# Altium project DSP-V1.0.PrjPcb
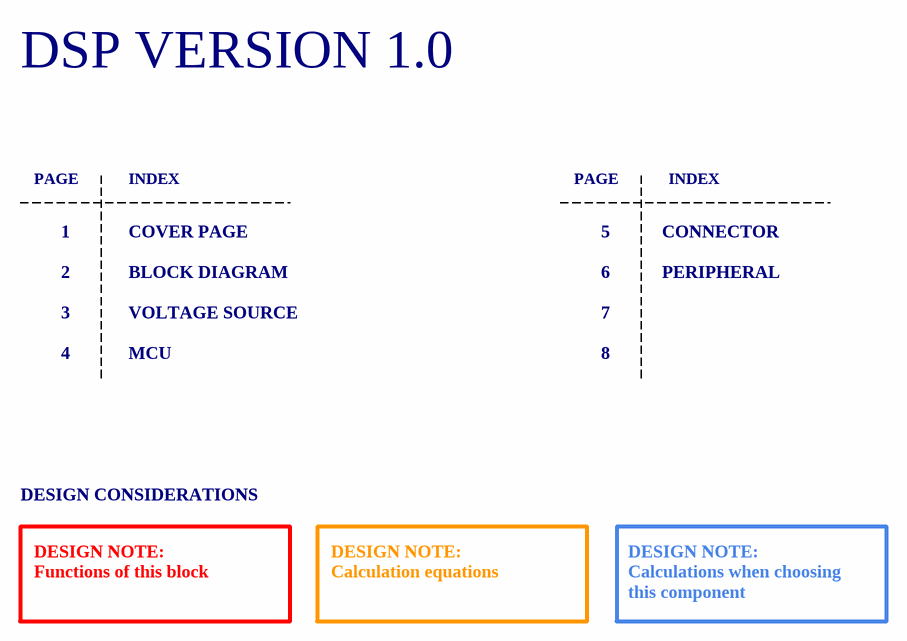
[diagram p0: Cover Page.SchDoc]
6 sheets, 226 parts. Net scope: global (net labels, ports and power ports of the same name join across sheets).
Board files: DSP-V1.0.PcbDoc, assembly.PcbDoc
Sheets:
  Cover Page.SchDoc
  Block Diagram.SchDoc
  Voltage Source.SchDoc
  MCU.SchDoc
  CONNECTOR.SchDoc
  PERIPHERAL.SchDoc

## Sheet Cover Page.SchDoc: Cover Page
size A4; Author: DODANHLUONG; Revision: 1.0; SheetNumber: 1; SheetTotal: 5; ProjectTitle: DSP_VERSION_1.0

### Notes on the sheet
- DSP VERSION 1.0
- PAGE
- INDEX
- 1
- 2
- COVER PAGE
- BLOCK DIAGRAM
- 5
- 6
- CONNECTOR
- PERIPHERAL
- 3
- 4
- VOLTAGE SOURCE
- MCU
- 7
- 8
- DESIGN CONSIDERATIONS
- DESIGN NOTE:
  Functions of this block
- DESIGN NOTE:
  Calculation equations
- DESIGN NOTE:
  Calculations when choosing this component
- Author:
- Title:
- Size:
- A4
- Project:
- Approved:
- Revision:
- Modified Date:
- CONFIDENTIAL
- Date:
- SW Version:

## Sheet Block Diagram.SchDoc: Block Diagram
size A4; Author: DODANHLUONG; Revision: 1.0; SheetNumber: 2; SheetTotal: 6; ProjectTitle: DSP_VERSION_1.0

### Notes on the sheet
- Author:
- Title:
- Size:
- A4
- Project:
- Approved:
- Revision:
- Modified Date:
- CONFIDENTIAL
- Date:
- SW Version:

## Sheet Voltage Source.SchDoc: Voltage Source
size A3; Author: DODANHLUONG; Revision: 1.0; SheetNumber: 3; SheetTotal: 6; ProjectTitle: DSP_VERSION_1.0
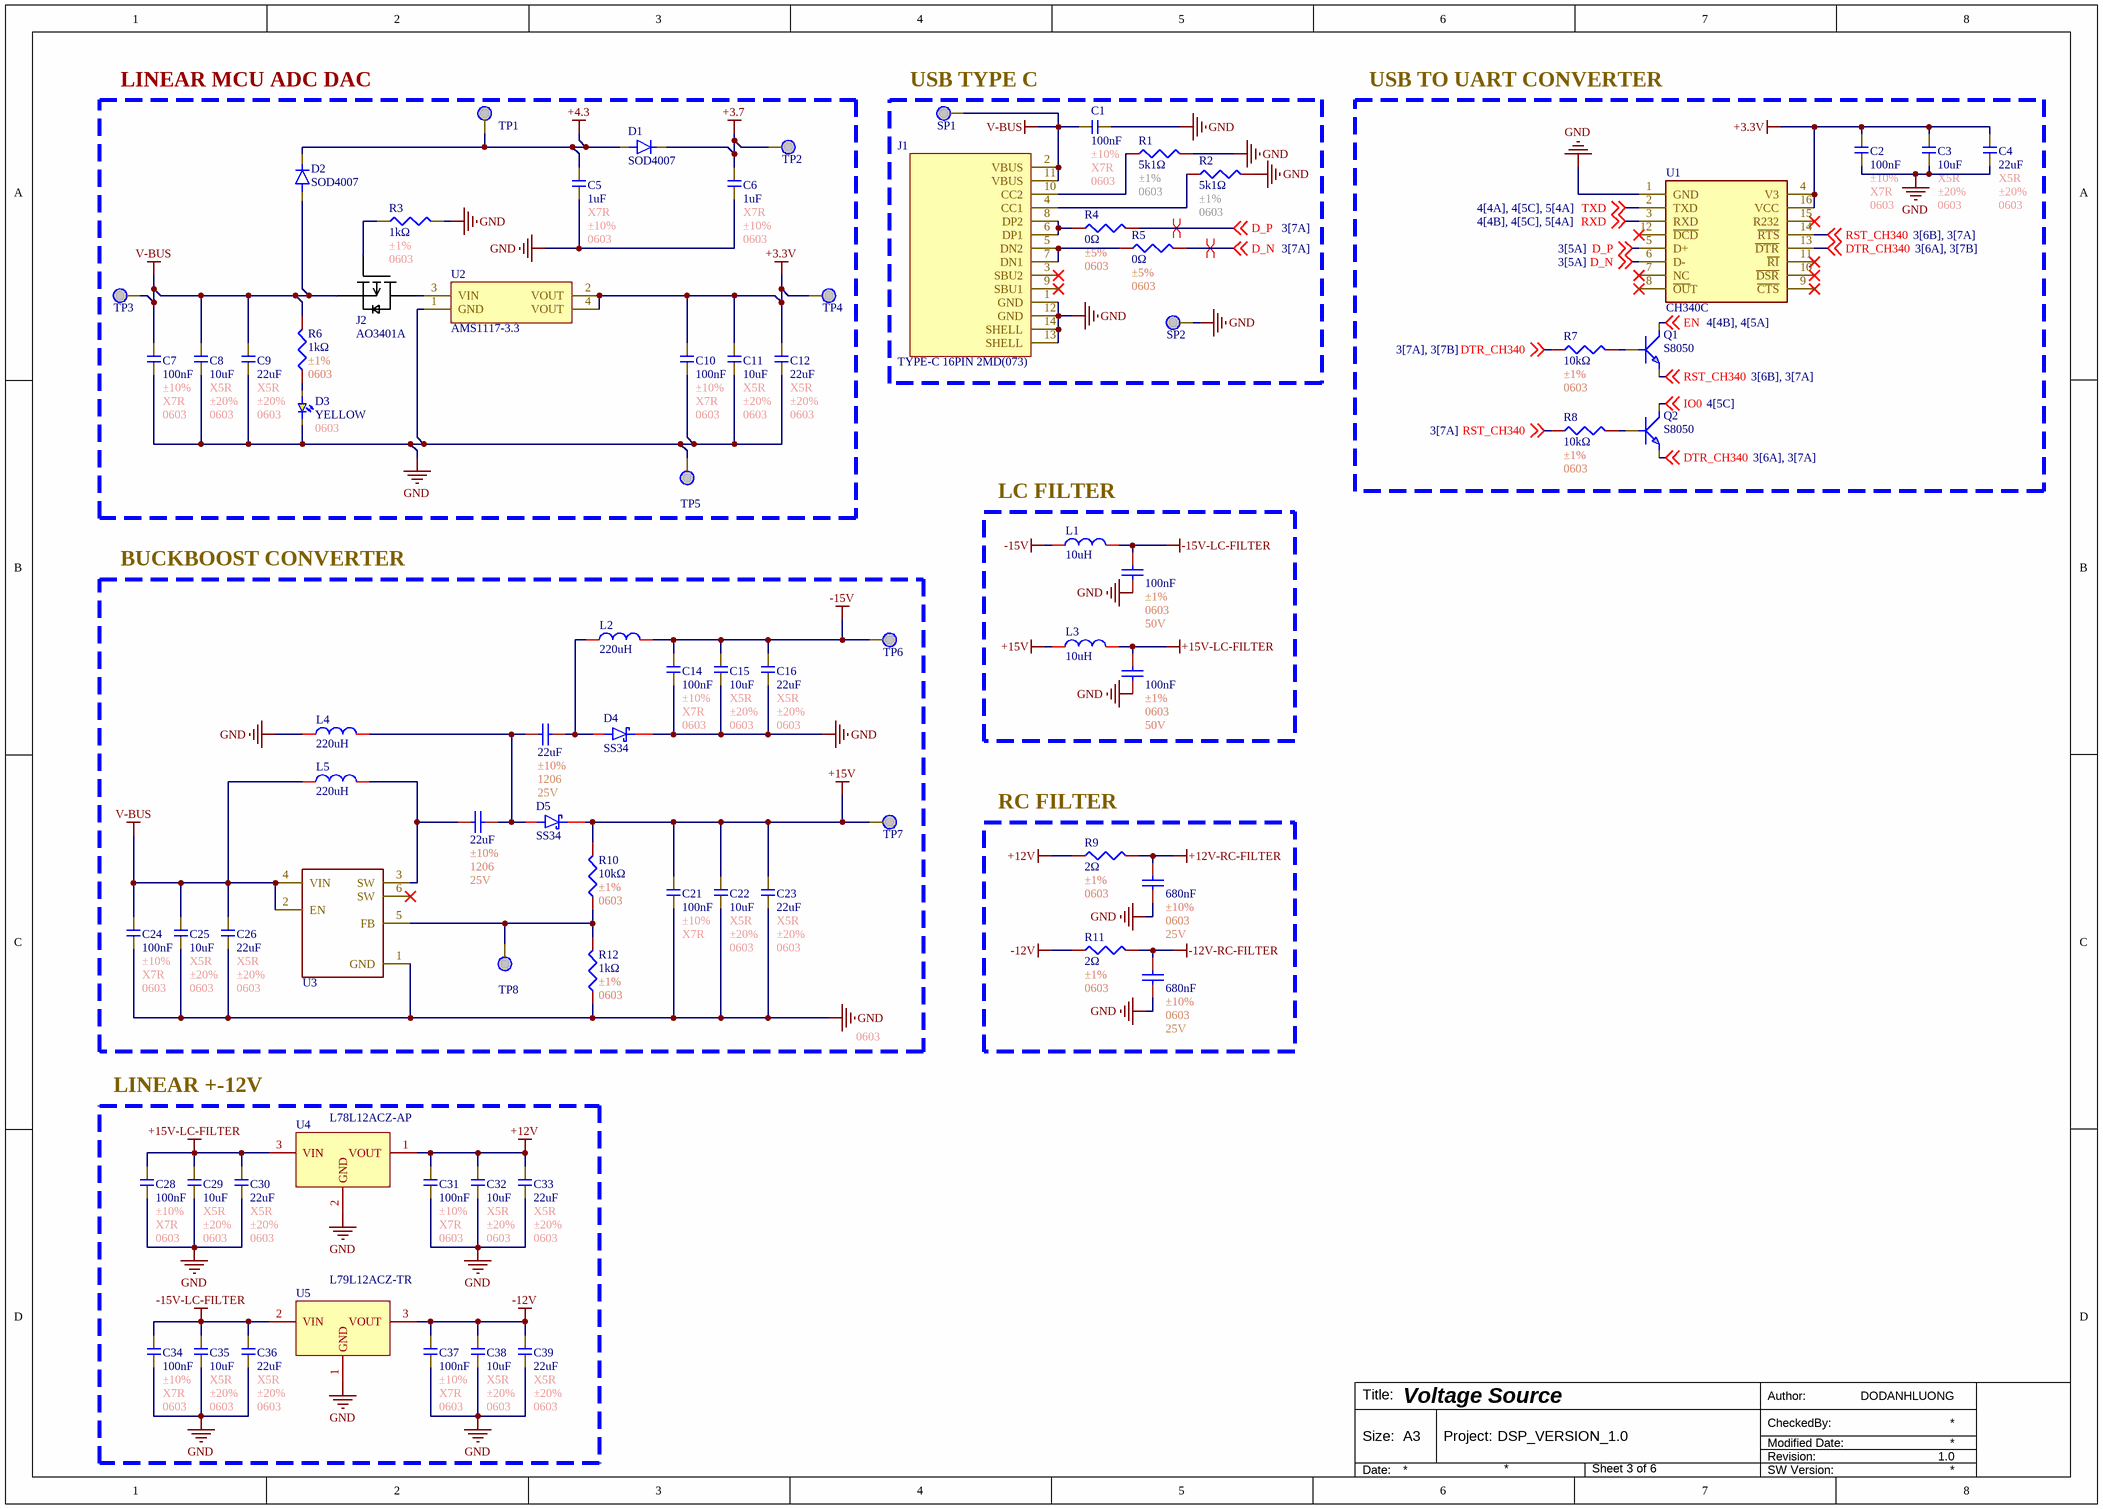
[diagram p1: Voltage Source.SchDoc]

### Parts
C1  100nF  Tolerance: ±10%  Temperature Coefficient: X7R  Package: 0603  [C0603]
C2  100nF  Tolerance: ±10%  Temperature Coefficient: X7R  Package: 0603  [C0603]
C3  10uF  Temperature Coefficient: X5R  Tolerance: ±20%  Package: 0603  [C0603]
C4  22uF  Temperature Coefficient: X5R  Tolerance: ±20%  Package: 0603  [C0603]
C5  1uF  Temperature Coefficient: X7R  Tolerance: ±10%  Package: 0603  [C0603]
C6  1uF  Temperature Coefficient: X7R  Tolerance: ±10%  Package: 0603  [C0603]
C7  100nF  Tolerance: ±10%  Temperature Coefficient: X7R  Package: 0603  [C0603]
C8  10uF  Temperature Coefficient: X5R  Tolerance: ±20%  Package: 0603  [C0603]
C9  22uF  Temperature Coefficient: X5R  Tolerance: ±20%  Package: 0603  [C0603]
C10  100nF  Tolerance: ±10%  Temperature Coefficient: X7R  Package: 0603  [C0603]
C11  10uF  Temperature Coefficient: X5R  Tolerance: ±20%  Package: 0603  [C0603]
C12  22uF  Temperature Coefficient: X5R  Tolerance: ±20%  Package: 0603  [C0603]
C13  100nF  Tolerance: ±1%  Package: 0603  Voltage Rating: 50V  [C0603]
C14  100nF  Tolerance: ±10%  Temperature Coefficient: X7R  Package: 0603  [C0603]
C15  10uF  Temperature Coefficient: X5R  Tolerance: ±20%  Package: 0603  [C0603]
C16  22uF  Temperature Coefficient: X5R  Tolerance: ±20%  Package: 0603  [C0603]
C17  100nF  Tolerance: ±1%  Package: 0603  Voltage Rating: 50V  [C0603]
C18  22uF  Tolerance: ±10%  Package: 1206  Voltage Rating: 25V  [C1206]
C19  22uF  Tolerance: ±10%  Package: 1206  Voltage Rating: 25V  [C1206]
C20  680nF  Tolerance: ±10%  Package: 0603  Voltage Rating: 25V  [C0603]
C21  100nF  Tolerance: ±10%  Temperature Coefficient: X7R  Package: 0603  [C0603]
C22  10uF  Temperature Coefficient: X5R  Tolerance: ±20%  Package: 0603  [C0603]
C23  22uF  Temperature Coefficient: X5R  Tolerance: ±20%  Package: 0603  [C0603]
C24  100nF  Tolerance: ±10%  Temperature Coefficient: X7R  Package: 0603  [C0603]
C25  10uF  Temperature Coefficient: X5R  Tolerance: ±20%  Package: 0603  [C0603]
C26  22uF  Temperature Coefficient: X5R  Tolerance: ±20%  Package: 0603  [C0603]
C27  680nF  Tolerance: ±10%  Package: 0603  Voltage Rating: 25V  [C0603]
C28  100nF  Tolerance: ±10%  Temperature Coefficient: X7R  Package: 0603  [C0603]
C29  10uF  Temperature Coefficient: X5R  Tolerance: ±20%  Package: 0603  [C0603]
C30  22uF  Temperature Coefficient: X5R  Tolerance: ±20%  Package: 0603  [C0603]
C31  100nF  Tolerance: ±10%  Temperature Coefficient: X7R  Package: 0603  [C0603]
C32  10uF  Temperature Coefficient: X5R  Tolerance: ±20%  Package: 0603  [C0603]
C33  22uF  Temperature Coefficient: X5R  Tolerance: ±20%  Package: 0603  [C0603]
C34  100nF  Tolerance: ±10%  Temperature Coefficient: X7R  Package: 0603  [C0603]
C35  10uF  Temperature Coefficient: X5R  Tolerance: ±20%  Package: 0603  [C0603]
C36  22uF  Temperature Coefficient: X5R  Tolerance: ±20%  Package: 0603  [C0603]
C37  100nF  Tolerance: ±10%  Temperature Coefficient: X7R  Package: 0603  [C0603]
C38  10uF  Temperature Coefficient: X5R  Tolerance: ±20%  Package: 0603  [C0603]
C39  22uF  Temperature Coefficient: X5R  Tolerance: ±20%  Package: 0603  [C0603]
D1  SOD4007  [SOD4007]
D2  SOD4007  [SOD4007]
D3  YELLOW  Package: 0603  [LED0603]
D4  SS34  [SS34]
D5  SS34  [SS34]
J1  TYPE-C 16PIN 2MD(073)  [TYPE_C_FAMALE]
J2  AO3401A  [AO3401A]
L1  10uH  [CD43]
L2  220uH  [CD43]
L3  10uH  [CD43]
L4  220uH  [CD43]
L5  220uH  [CD43]
Q1  S8050  [S8050]
Q2  S8050  [S8050]
R1  5k1Ω  Tolerance: ±1%  Package: 0603  [R0603]
R2  5k1Ω  Tolerance: ±1%  Package: 0603  [R0603]
R3  1kΩ  Tolerance: ±1%  Package: 0603  [R0603]
R4  0Ω  Tolerance: ±5%  Package: 0603  [R0603]
R5  0Ω  Tolerance: ±5%  Package: 0603  [R0603]
R6  1kΩ  Tolerance: ±1%  Package: 0603  [R0603]
R7  10kΩ  Tolerance: ±1%  Package: 0603  [R0603]
R8  10kΩ  Tolerance: ±1%  Package: 0603  [R0603]
R9  2Ω  Tolerance: ±1%  Package: 0603  [R0603]
R10  10kΩ  Tolerance: ±1%  Package: 0603  [R0603]
R11  2Ω  Tolerance: ±1%  Package: 0603  [R0603]
R12  1kΩ  Tolerance: ±1%  Package: 0603  [R0603]
SP1  SP  [SP]  (value not drawn)
SP2  SP  [SP]  (value not drawn)
TP1  TP  [TP]  (value not drawn)
TP2  TP  [TP]  (value not drawn)
TP3  TP  [TP]  (value not drawn)
TP4  TP  [TP]  (value not drawn)
TP5  TP  [TP]  (value not drawn)
TP6  TP  [TP]  (value not drawn)
TP7  TP  [TP]  (value not drawn)
TP8  TP  [TP]  (value not drawn)
U1  CH340C  [CH340C]
U2  AMS1117-3.3  [AMS1117-3.3]
U3  XL6009  [XL6009]  (value not drawn)
U4  L78L12ACZ-AP  [L78L12ACZ-AP]
U5  L79L12ACZ-TR  [L79L12ACZ-TR]

### Blocks framed on the sheet
LINEAR MCU ADC DAC: C5-C12 D1-D3 J2 R3 R6 TP1-TP5 U2
USB TYPE C: C1 J1 R1 R2 R4 R5 SP1 SP2
USB TO UART CONVERTER: C2-C4 Q1 Q2 R7 R8 U1
LC FILTER: C13 C17 L1 L3
BUCKBOOST CONVERTER: C14-C16 C18 C19 C21-C26 D4 D5 L2 L4 L5 R10 R12 TP6-TP8 U3
RC FILTER: C20 C27 R9 R11
LINEAR +-12V: C28-C39 U4 U5

### Nets
+3.3V: C2.2 C3.2 C4.2 C10.2 C11.2 C12.2 TP4.1 U1.4(V3) U1.16(VCC) U2.2(VOUT) U2.4(VOUT)
+3.7: C6.2 D1.1(C) TP2.1
+4.3: C5.2 D1.2(A) D2.1(C) TP1.1
+12V: C31.2 C32.2 C33.2 R9.1 U4.1(VOUT)
+12V-RC-FILTER: C20.1 R9.2
+15V: C21.2 C22.2 C23.2 D5.1 L3.1 R10.2 TP7.1
+15V-LC-FILTER: C17.1 C28.2 C29.2 C30.2 L3.2 U4.3(VIN)
-12V: C37.2 C38.2 C39.2 R11.1 U5.3(VOUT)
-12V-RC-FILTER: C27.1 R11.2
-15V: C14.2 C15.2 C16.2 L1.1 L2.2 TP6.1
-15V-LC-FILTER: C13.1 C34.2 C35.2 C36.2 L1.2 U5.2(VIN)
GND: C1.1 C2.1 C3.1 C4.1 C5.1 C6.1 C7.1 C8.1 C9.1 C10.1 C11.1 C12.1 C13.2 C14.1 C15.1 C16.1 C17.2 C20.2 C21.1 C22.1 C23.1 C24.1 C25.1 C26.1 C27.2 C28.1 C29.1 C30.1 C31.1 C32.1 C33.1 C34.1 C35.1 C36.1 C37.1 C38.1 C39.1 D3.1 D4.1 J1.1(GND) J1.12(GND) J1.13(SHELL) J1.14(SHELL) L4.1 R1.2 R2.2 R3.2 R12.1 SP2.1 TP5.1 U1.1(GND) U2.1(GND) U3.1(GND) U4.2(GND) U5.1(GND)
V-BUS: C1.2 C7.2 C8.2 C9.2 C24.2 C25.2 C26.2 D2.2(A) J1.2(VBUS) J1.11(VBUS) J2.2(S) L5.1 R6.2 SP1.1 TP3.1 U3.2(EN) U3.4(VIN)
D_N: R5.2 U1.6(D-) ; off-sheet D_N
D_P: R4.2 U1.5(D+) ; off-sheet D_P
DTR_CH340: Q2.2(E) R7.1 U1.13(~{DTR}) ; off-sheet DTR_CH340
EN: Q1.3(C) ; off-sheet EN
IO0: Q2.3(C) ; off-sheet IO0
RST_CH340: Q1.2(E) R8.1 U1.14(~{RTS}) ; off-sheet RST_CH340
RXD: U1.3(RXD) ; off-sheet RXD
TXD: U1.2(TXD) ; off-sheet TXD
NetC18_1: C18.1 D4.2 L2.1
NetC18_2: C18.2 C19.1 D5.2 L4.2
NetC19_2: C19.2 L5.2 U3.3(SW)
NetD3_2: D3.2 R6.1
NetJ1_4: J1.4(CC1) R2.1
NetJ1_5: J1.5(DN2) J1.7(DN1) R5.1
NetJ1_6: J1.6(DP1) J1.8(DP2) R4.1
NetJ1_10: J1.10(CC2) R1.1
NetJ2_1: J2.1(G) R3.1
NetJ2_3: J2.3(D) U2.3(VIN)
NetQ1_1: Q1.1(B) R7.2
NetQ2_1: Q2.1(B) R8.2
NetR10_1: R10.1 R12.2 TP8.1 U3.5(FB)

Not connected (* = marked no-connect by the designer): J1 3(SBU2)* 9(SBU1)*; U1 7(NC)* 8(~{OU}T)* 9(~{CTS})* 10(~{DSR})* 11(~{RI})* 12(~{DCD})* 15(R232)*; U3 6(SW)*

### Layout directives
differential pair: D_N, D_P

### Notes on the sheet
- Author:
- Title:
- Size:
- A3
- Project:
- Revision:
- Modified Date:
- CheckedBy:
- Date:
- SW Version:

### Library data of the parts
C1 C2 C7 C10 C14 C21 C24 C28 C31 C34 C37 = C0603_100nF_±10%_X7R: 50V 100nF X7R ±10% 0603 Multilayer Ceramic Capacitors MLCC - SMD/SMT ROHS; Manufacturer: YAGEO; Mfr. Part #: CC0603KRX7R9BB104; LCSC Part #: C14663; Capacitance: 100nF; Link: https://www.lcsc.com/product-detail/C14663.html?s_z=n_capital%25200603%2520100nf
C3 C8 C11 C15 C22 C25 C29 C32 C35 C38 = C0603_10uF_±10%_X7R: 25V 10uF X5R ±20% 0603 Multilayer Ceramic Capacitors MLCC - SMD/SMT ROHS; Manufacturer: YAGEO; Mfr. Part #: CC0603MRX5R8BB106; LCSC Part #: C596327; Capacitance: 10uF; Link: https://www.lcsc.com/product-detail/C596327.html?s_z=n_capital%25200603%252010uF%2520yageo
C4 C9 C12 C16 C23 C26 C30 C33 C36 C39 = C0603_22uF_±20%_X5R: 6.3V 22uF X5R ±20% 0603 Multilayer Ceramic Capacitors MLCC - SMD/SMT ROHS; Manufacturer: YAGEO; Mfr. Part #: CC0603MRX5R5BB226; LCSC Part #: C109448; ComponentLink1Description: New link; ComponentLink1URL: *; Capacitance: 22uF; Link: https://www.lcsc.com/product-detail/C109448.html?s_z=n_capital%25200603%252022uf%2520yageo
C5 C6 = C0603_1uF_±10%_X7R: 50V 1uF X7R ±10% 0603 Multilayer Ceramic Capacitors MLCC - SMD/SMT ROHS; Manufacturer: YAGEO; Mfr. Part #: CC0603KRX7R9BB105; LCSC Part #: C559769; Capacitance: 1uF; Link: https://www.lcsc.com/product-detail/C559769.html?s_z=n_capital%25200603%25201uF%2520yageo
C13 C17 = C0603_100nF_±1%: 50V 10pF NP0 ±1% 0402 Multilayer Ceramic Capacitors MLCC - SMD/SMT ROHS; Manufacturer: YAGEO; Mfr. Part #: CC0402FRNPO9BN100; LCSC Part #: C513681; Link: https://www.lcsc.com/product-detail/C513681.html?s_z=n_capital%2520yageo%252010pF%25200402; Capacitance: 100nF
C18 C19 = C1206_22uF_±1%: 25V 22uF X5R ±10% 1206 Multilayer Ceramic Capacitors MLCC - SMD/SMT ROHS; Manufacturer: YAGEO; Mfr. Part #: CC1206KKX5R8BB226; LCSC Part #: C2178233; Link: https://www.lcsc.com/product-detail/C2178233.html?s_z=n_capital%25201206%252022uf%2520yageo; Capacitance: 22uF
C20 C27 = C0603_680nF_±1%: 25V 680nF X5R ±10% 0603 Multilayer Ceramic Capacitors MLCC - SMD/SMT ROHS; Manufacturer: YAGEO; Mfr. Part #: CC0603KRX5R8BB684; LCSC Part #: C327005; Link: https://www.lcsc.com/product-detail/C327005.html?s_z=n_capital%2520yageo%2520680%2520nF%25200603; Capacitance: 680nF
D1 D2 = SOD4007: 1A Independent 1kV 1.1V@1A SOD-123FL Diodes - General Purpose ROHS; Manufacturer: MDD(Microdiode Semiconductor); Mfr. Part #: SOD4007; Package: SOD-123FL; LCSC Part #: C18124; Link: https://www.lcsc.com/product-detail/C18124.html?s_z=n_SOD4007; Voltage - DC Reverse(Vr): 1kV; Current - Rectified: 1A
D3 = D0603_YELLOW: 25mcd~40mcd Water Clear -40℃~+85℃ 624nm Red 120° 60mW 0402 LED Indication - Discrete ROHS; Manufacturer: XINGLIGHT; Mfr. Part #: XL-1005UGC; Voltage - Forward(Vf): 3V; LCSC Part #: C965793; Power(Watts): 60mW; Link: https://www.lcsc.com/product-detail/C136765.html?s_z=n_LED%25200402%2520RED; Illumination Color: YELLOW
D4 D5 = SS34: 40V Independent 3A 550mV@3A SMA(DO-214AC) Schottky Diodes ROHS; Manufacturer: MDD(Microdiode Semiconductor); Mfr. Part #: SS34; LCSC Part #: C8678; Package: SMA(DO-214AC); Voltage - DC Reverse(Vr): 40V; Current - Rectified: 3A; Link: https://www.lcsc.com/product-detail/C8678.html?s_z=n_SS34
J1 = TYPE_C_FAMALE_16PIN: 3A 1 Surface Mount, Right Angle 16P Female -25℃~+85℃ Type-C SMD USB Connectors ROHS; Manufacturer: SHOU HAN; Mfr. Part #: TYPE-C 16PIN 2MD(073); LCSC Part #: C2765186; Package: SMD; Number of Contacts: 16P; Link: https://www.lcsc.com/product-detail/C2765186.html?s_z=n_type%2520c
J2 = AO3401: 30V 4A 900mV@250uA 1 P-Channel SOT-23 MOSFETs ROHS; Manufacturer: AOS; Mfr. Part #: AO3401A; LCSC Part #: C15127; Package: SOT-23; Current - Continuous Drain(Id): 4A; Drain to Source Voltage: 30V; Link: https://www.lcsc.com/product-detail/C15127.html?s_z=n_AO3401
L1 L3 = CD4-10UH: 1.15A 10uH Unshielded Inductor ±20% SMD,4x4.5mm Power Inductors ROHS; Manufacturer: ZE; Mfr. Part #: CD43-100M; Key Attributes: FIXED IND 10uH 1.15A 182mΩ SMD,4x4.5mm; DC Resistance(DCR): 182mΩ; LCSC Part #: C18734467; Package: SMD,4x4.5mm; Link: https://www.lcsc.com/product-detail/C18734467.html?s_z=n_CD43%252010uH; Tolerance: ±20%; Current Rating: 1.15A; Inductance: 10uH
L2 L4 L5 = CD4-220UH: 360mA 220uH ±20% SMD,4.5x4x3.2mm Power Inductors ROHS; Manufacturer: YJYCOIN; Mfr. Part #: CD43YP0403-221M; Key Attributes: FIXED IND 220uH 360mA 3.4Ω SMD,4.5x4x3.2mm; DC Resistance(DCR): 3.4Ω; LCSC Part #: C492283; Package: SMD,4.5x4x3.2mm; Link: https://www.lcsc.com/product-detail/C492283.html?s_z=n_220uH%2520cd43; Tolerance: ±20%; Current Rating: 360mA; Inductance: 220uH
Q1 Q2 = S8050: 25V 300mW 500mA SOT-23 Bipolar (BJT) ROHS; Manufacturer: JSMSEMI; Key Attributes: TRANS 25V 500mA SOT-23; Transition frequency(fT): 150MHz; Vce Saturation(VCE(sat)): 600mV; Mfr. Part #: S8050; LCSC Part #: C916390; Package: SOT-23; Link: https://www.lcsc.com/product-detail/C916390.html?s_z=n_s8050; Current - Collector(Ic): 500mA
R1 R2 = R0603_5k1Ω_±1%: 100mW Thick Film Resistor 75V ±100ppm/℃ ±1% 5.1kΩ 0603 Chip Resistor - Surface Mount ROHS; Manufacturer: FOJAN; Mfr. Part #: FRC0603F5101TS; Key Attributes: RES 5.1kΩ ±1% 100mW 0603; LCSC Part #: C2907044; Link: https://www.lcsc.com/product-detail/C2907044.html?s_z=n_5k1%25200603; Resistance: 5k1Ω
R3 = R0603_1kΩ_±1%: 100mW Thick Film Resistor 75V ±100ppm/℃ ±1% 1kΩ 0603 Chip Resistor - Surface Mount ROHS; Manufacturer: YAGEO; Mfr. Part #: RC0603FR-071KL; Key Attributes: RES 1kΩ ±1% 100mW 0603; LCSC Part #: C22548; Link: https://www.lcsc.com/product-detail/C22548.html?s_z=n_resistor%25200603%25201k%2520yageo; Resistance: 1kΩ
R4 R5 = R0603_0Ω_±5%: 100mW Thick Film Resistor 75V ±5% 0Ω 0603 Chip Resistor - Surface Mount ROHS; Manufacturer: YAGEO; Mfr. Part #: RC0603JR-070RL; Key Attributes: RES 0Ω ±5% 100mW 0603; LCSC Part #: C95177; Resistance: 0Ω; Link: https://www.lcsc.com/product-detail/C138066.html?s_z=n_resistor%25200402%252010R
R6 R12 = R0603_1kΩ_±1%: 62.5mW Thick Film Resistor 50V ±1% ±200ppm/℃ 10Ω 0402 Chip Resistor - Surface Mount ROHS; Manufacturer: YAGEO; Mfr. Part #: RC0402FR-0710RL; LCSC Part #: C138066; Resistance: 1kΩ; Link: https://www.lcsc.com/product-detail/C138066.html?s_z=n_resistor%25200402%252010R
R7 R8 R10 = R0603_10kΩ_±1%: 62.5mW Thick Film Resistor 50V ±1% ±200ppm/℃ 10Ω 0402 Chip Resistor - Surface Mount ROHS; Manufacturer: YAGEO; Mfr. Part #: RC0402FR-0710RL; LCSC Part #: C138066; Resistance: 10kΩ; Link: https://www.lcsc.com/product-detail/C138066.html?s_z=n_resistor%25200402%252010R
R9 R11 = R0603_2Ω_±5%: 100mW Thick Film Resistor 75V ±1% ±200ppm/℃ 2Ω 0603 Chip Resistor - Surface Mount ROHS; Manufacturer: YAGEO; Mfr. Part #: RC0603FR-072RL; Key Attributes: RES 0Ω ±5% 100mW 0603; LCSC Part #: C185341; Resistance: 2Ω; Link: https://www.lcsc.com/product-detail/C185341.html?s_z=n_resistor%2520yageo%25202%25CE%25A9%25200603
U1 = CH340C: 2Mbps Transceiver USB 2.0 SOP-16 USB Converters ROHS; Manufacturer: WCH; Voltage - Supply: 3.3V;5V; LCSC Part #: C84681; Package: SOP-16; Link: https://www.lcsc.com/product-detail/C84681.html?s_z=n_CH340C; Mfr. Part #: CH340C
U2 = AMS1117-3.3: 72dB@(120Hz) 1A Fixed 3.3V Positive 16V SOT-223 Voltage Regulators - Linear, Low Drop Out (LDO) Regulators ROHS; Manufacturer: Advanced Monolithic Systems; LCSC Part #: C6186; Link: https://www.lcsc.com/product-detail/C6186.html?s_z=n_ams1117-3.3; Output Current: 1A; Package: SOT-223; Mfr. Part #: AMS1117-3.3
U4 = L7812CV-DG: 42dB@(120Hz) 100mA Fixed 12V Positive 35V TO-92-3 Voltage Regulators - Linear, Low Drop Out (LDO) Regulators ROHS; Parameter 1: ST; Key Attributes: 0.1A Positive Voltage Regulator; Number of Outputs: 1; Voltage Dropout: 1.7V; Mfr. Part #: L78L12ACZ-AP; LCSC Part #: C262913; Package: TO-92-3; Voltage - Supply: 35V; Output Voltage: 12V; Output Configuration: Positive; Link: https://www.lcsc.com/product-detail/C262913.html?s_z=n_78L12
U5 = L79L12ACZ-TR: 37dB@(120Hz) 100mA Fixed 12V Negative 27V TO-92-3 Voltage Regulators - Linear, Low Drop Out (LDO) Regulators ROHS; Parameter 1: ST; Key Attributes: Negative Voltage Regulator; Number of Outputs: 1; Voltage Dropout: 1.7V; Output Configuration: Positive; Mfr. Part #: L79L12ACZ-TR; LCSC Part #: C2942984; Package: TO-92-3; Voltage - Supply: 27V; Output Voltage: 12V; Link: https://www.lcsc.com/product-detail/C2942984.html?s_z=n_79L12

## Sheet MCU.SchDoc: MCU
size A3; Author: DODANHLUONG; Revision: 1.0; SheetNumber: 4; SheetTotal: 6; ProjectTitle: KIT ARDUINO VERSION 1.0
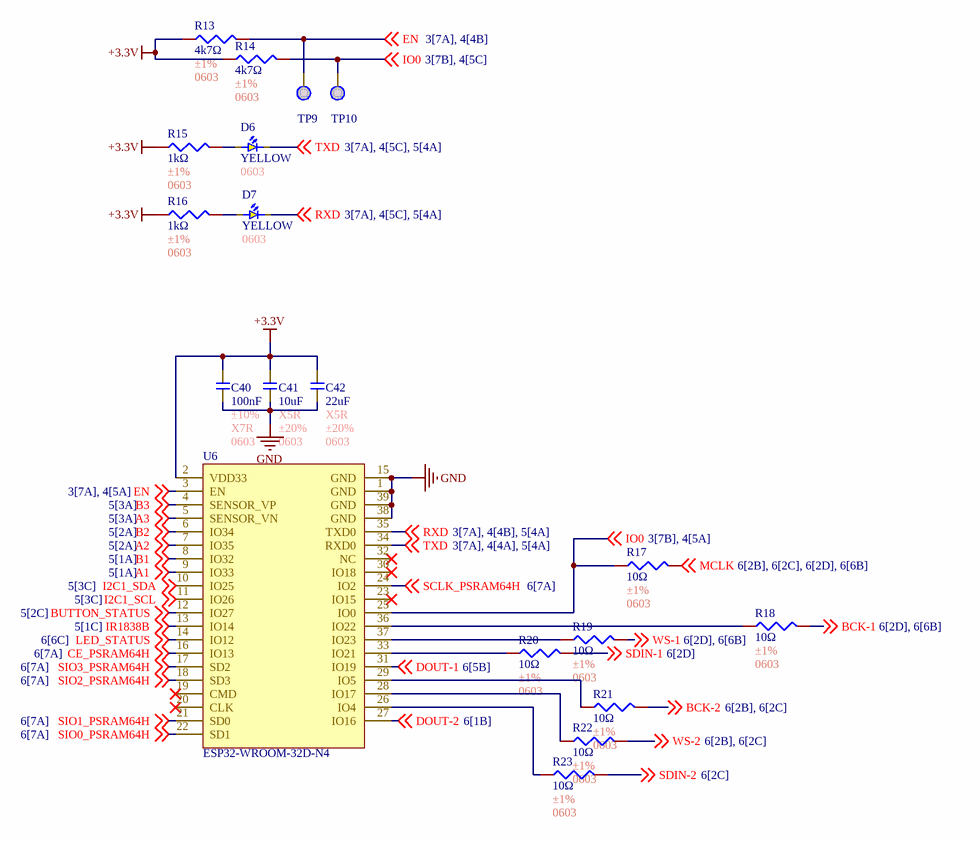
[diagram p2: MCU.SchDoc]

### Parts
C40  100nF  Tolerance: ±10%  Temperature Coefficient: X7R  Package: 0603  [C0603]
C41  10uF  Temperature Coefficient: X5R  Tolerance: ±20%  Package: 0603  [C0603]
C42  22uF  Temperature Coefficient: X5R  Tolerance: ±20%  Package: 0603  [C0603]
D6  YELLOW  Package: 0603  [LED0603]
D7  YELLOW  Package: 0603  [LED0603]
R13  4k7Ω  Tolerance: ±1%  Package: 0603  [R0603]
R14  4k7Ω  Tolerance: ±1%  Package: 0603  [R0603]
R15  1kΩ  Tolerance: ±1%  Package: 0603  [R0603]
R16  1kΩ  Tolerance: ±1%  Package: 0603  [R0603]
R17  10Ω  Tolerance: ±1%  Package: 0603  [R0603]
R18  10Ω  Tolerance: ±1%  Package: 0603  [R0603]
R19  10Ω  Tolerance: ±1%  Package: 0603  [R0603]
R20  10Ω  Tolerance: ±1%  Package: 0603  [R0603]
R21  10Ω  Tolerance: ±1%  Package: 0603  [R0603]
R22  10Ω  Tolerance: ±1%  Package: 0603  [R0603]
R23  10Ω  Tolerance: ±1%  Package: 0603  [R0603]
TP9  TP  [TP]  (value not drawn)
TP10  TP  [TP]  (value not drawn)
U6  ESP32-WROOM-32D-N4  [ESP32-WROOM-32D-N4]

### Nets
+3.3V: C40.2 C41.2 C42.2 R13.1 R14.1 R15.1 R16.1 U6.2(VDD33)
GND: C40.1 C41.1 C42.1 U6.1(GND) U6.15(GND) U6.38(GND) U6.39(GND)
A1: U6.9(IO33) ; off-sheet A1
A2: U6.7(IO35) ; off-sheet A2
A3: U6.5(SENSOR_VN) ; off-sheet A3
B1: U6.8(IO32) ; off-sheet B1
B2: U6.6(IO34) ; off-sheet B2
B3: U6.4(SENSOR_VP) ; off-sheet B3
BCK-1: R18.2 ; off-sheet BCK-1
BCK-2: R21.2 ; off-sheet BCK-2
BUTTON_STATUS: U6.12(IO27) ; off-sheet BUTTON_STATUS
CE_PSRAM64H: U6.16(IO13) ; off-sheet CE_PSRAM64H
DOUT-1: U6.31(IO19) ; off-sheet DOUT-1
DOUT-2: U6.27(IO16) ; off-sheet DOUT-2
EN: R13.2 TP9.1 U6.3(EN) ; off-sheet EN
I2C1_SCL: U6.11(IO26) ; off-sheet I2C1_SCL
I2C1_SDA: U6.10(IO25) ; off-sheet I2C1_SDA
IO0: R14.2 R17.1 TP10.1 U6.25(IO0) ; off-sheet IO0
IR1838B: U6.13(IO14) ; off-sheet IR1838B
LED_STATUS: U6.14(IO12) ; off-sheet LED_STATUS
MCLK: R17.2 ; off-sheet MCLK
RXD: D7.1 U6.35(TXD0) ; off-sheet RXD
SCLK_PSRAM64H: U6.24(IO2) ; off-sheet SCLK_PSRAM64H
SDIN-1: R20.2 ; off-sheet SDIN-1
SDIN-2: R23.2 ; off-sheet SDIN-2
SIO0_PSRAM64H: U6.22(SD1) ; off-sheet SIO0_PSRAM64H
SIO1_PSRAM64H: U6.21(SD0) ; off-sheet SIO1_PSRAM64H
SIO2_PSRAM64H: U6.18(SD3) ; off-sheet SIO2_PSRAM64H
SIO3_PSRAM64H: U6.17(SD2) ; off-sheet SIO3_PSRAM64H
TXD: D6.1 U6.34(RXD0) ; off-sheet TXD
WS-1: R19.2 ; off-sheet WS-1
WS-2: R22.2 ; off-sheet WS-2
NetD6_2: D6.2 R15.2
NetD7_2: D7.2 R16.2
NetR18_1: R18.1 U6.36(IO22)
NetR19_1: R19.1 U6.37(IO23)
NetR20_1: R20.1 U6.33(IO21)
NetR21_1: R21.1 U6.29(IO5)
NetR22_1: R22.1 U6.28(IO17)
NetR23_1: R23.1 U6.26(IO4)

Not connected (* = marked no-connect by the designer): U6 19(CMD)* 20(CLK)* 23(IO15)* 30(IO18)* 32(NC)*

### Notes on the sheet
- Author:
- Title:
- Size:
- A3
- Project:
- Revision:
- Modified Date:
- CheckedBy:
- Date:
- SW Version:

### Library data of the parts
C40 = C0603_100nF_±10%_X7R: as C1 on sheet Voltage Source; LCSC Part #: C14663; Capacitance: 100nF; Link: https://www.lcsc.com/product-detail/C14663.html?s_z=n_capital%25200603%2520100nf
C41 = C0603_10uF_±10%_X7R: as C3 on sheet Voltage Source; LCSC Part #: C596327; Capacitance: 10uF; Link: https://www.lcsc.com/product-detail/C596327.html?s_z=n_capital%25200603%252010uF%2520yageo
C42 = C0603_22uF_±20%_X5R: as C4 on sheet Voltage Source; LCSC Part #: C109448; ComponentLink1Description: New link; ComponentLink1URL: *; Capacitance: 22uF; Link: https://www.lcsc.com/product-detail/C109448.html?s_z=n_capital%25200603%252022uf%2520yageo
D6 D7 = D0603_YELLOW: as D3 on sheet Voltage Source; LCSC Part #: C965793; Power(Watts): 60mW; Link: https://www.lcsc.com/product-detail/C136765.html?s_z=n_LED%25200402%2520RED; Illumination Color: YELLOW
R13 R14 = R0603_4k7Ω_±1%: 62.5mW Thick Film Resistor 50V ±1% ±200ppm/℃ 10Ω 0402 Chip Resistor - Surface Mount ROHS; Manufacturer: YAGEO; Mfr. Part #: RC0402FR-0710RL; LCSC Part #: C138066; Resistance: 4k7Ω; Link: https://www.lcsc.com/product-detail/C138066.html?s_z=n_resistor%25200402%252010R
R15 R16 = R0603_1kΩ_±1%: as R6 on sheet Voltage Source; LCSC Part #: C138066; Resistance: 1kΩ; Link: https://www.lcsc.com/product-detail/C138066.html?s_z=n_resistor%25200402%252010R
R17-R23 = R0603_10Ω_±1%: 62.5mW Thick Film Resistor 50V ±1% ±200ppm/℃ 10Ω 0402 Chip Resistor - Surface Mount ROHS; Manufacturer: YAGEO; Mfr. Part #: RC0402FR-0710RL; LCSC Part #: C138066; Resistance: 10Ω; Link: https://www.lcsc.com/product-detail/C138066.html?s_z=n_resistor%25200402%252010R
U6 = ESPRESSIF ESP32-WROOM-32D-N4: SMD,18x25.5mm WiFi Modules ROHS; Manufacturer: ESPRESSIF; Mfr. Part #: ESP32-WROOM-32D-N4; LCSC Part #: C473012; Package: SMD,18x25.5mm; Link: https://www.lcsc.com/product-detail/C473012.html?s_z=n_esp32-wroom-32d

## Sheet CONNECTOR.SchDoc: Connector and OTA
size A4; Author: DODANHLUONG; Revision: 1.0; SheetNumber: 5; SheetTotal: 6; ProjectTitle: DSP_VERSION_1.0
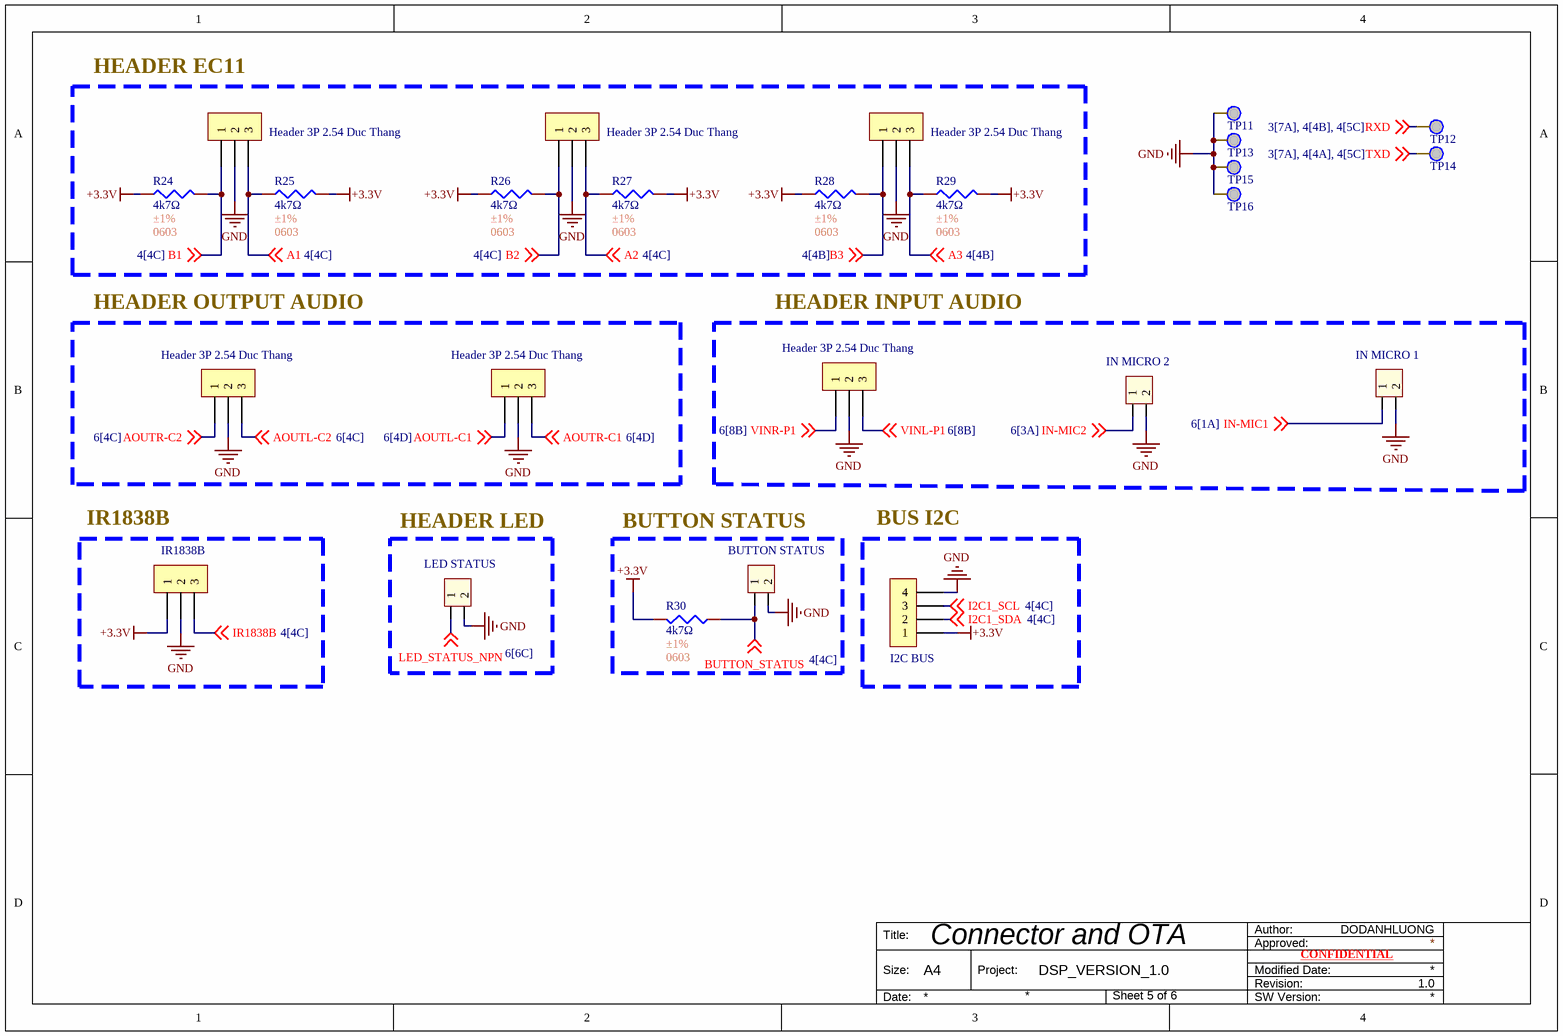
[diagram p3: CONNECTOR.SchDoc]

### Parts
H1  Header 3P 2.54 Duc Thang  [XH2.54M-3]
H2  Header 3P 2.54 Duc Thang  [XH2.54M-3]
H3  Header 3P 2.54 Duc Thang  [XH2.54M-3]
H4  Header 3P 2.54 Duc Thang  [XH2.54M-3]
H5  Header 3P 2.54 Duc Thang  [XH2.54M-3]
H6  Header 3P 2.54 Duc Thang  [XH2.54M-3]
H7  IN MICRO 1  [XH2.54M-2]
H8  IN MICRO 2  [XH2.54M-2]
H9  IR1838B  [XH2.54M-3]
H10  BUTTON STATUS  [XH2.54M-2]
H11  LED STATUS  [XH2.54M-2]
H12  I2C BUS  [XH2.54M-4]
R24  4k7Ω  Tolerance: ±1%  Package: 0603  [R0603]
R25  4k7Ω  Tolerance: ±1%  Package: 0603  [R0603]
R26  4k7Ω  Tolerance: ±1%  Package: 0603  [R0603]
R27  4k7Ω  Tolerance: ±1%  Package: 0603  [R0603]
R28  4k7Ω  Tolerance: ±1%  Package: 0603  [R0603]
R29  4k7Ω  Tolerance: ±1%  Package: 0603  [R0603]
R30  4k7Ω  Tolerance: ±1%  Package: 0603  [R0603]
TP11  TP  [TP]  (value not drawn)
TP12  TP  [TP]  (value not drawn)
TP13  TP  [TP]  (value not drawn)
TP14  TP  [TP]  (value not drawn)
TP15  TP  [TP]  (value not drawn)
TP16  TP  [TP]  (value not drawn)

### Blocks framed on the sheet
HEADER EC11: H1-H3 R24-R29
HEADER OUTPUT AUDIO: H5 H6
HEADER INPUT AUDIO: H4 H7 H8
IR1838B: H9
HEADER LED: H11
BUTTON STATUS: H10 R30
BUS I2C: H12

### Nets
+3.3V: H9.1 H12.1 R24.1 R25.2 R26.1 R27.2 R28.1 R29.2 R30.2
GND: H1.2 H2.2 H3.2 H4.2 H5.2 H6.2 H7.2 H8.2 H9.2 H10.2 H11.2 H12.4 TP11.1 TP13.1 TP15.1 TP16.1
A1: H1.3 R25.1 ; off-sheet A1
A2: H2.3 R27.1 ; off-sheet A2
A3: H3.3 R29.1 ; off-sheet A3
AOUTL-C1: H6.1 ; off-sheet AOUTL-C1
AOUTL-C2: H5.3 ; off-sheet AOUTL-C2
AOUTR-C1: H6.3 ; off-sheet AOUTR-C1
AOUTR-C2: H5.1 ; off-sheet AOUTR-C2
B1: H1.1 R24.2 ; off-sheet B1
B2: H2.1 R26.2 ; off-sheet B2
B3: H3.1 R28.2 ; off-sheet B3
BUTTON_STATUS: H10.1 R30.1 ; off-sheet BUTTON_STATUS
I2C1_SCL: H12.3 ; off-sheet I2C1_SCL
I2C1_SDA: H12.2 ; off-sheet I2C1_SDA
IN-MIC1: H7.1 ; off-sheet IN-MIC1
IN-MIC2: H8.1 ; off-sheet IN-MIC2
IR1838B: H9.3 ; off-sheet IR1838B
LED_STATUS_NPN: H11.1 ; off-sheet LED_STATUS_NPN
RXD: TP12.1 ; off-sheet RXD
TXD: TP14.1 ; off-sheet TXD
VINL-P1: H4.3 ; off-sheet VINL-P1
VINR-P1: H4.1 ; off-sheet VINR-P1

### Notes on the sheet
- Author:
- Title:
- Size:
- A4
- Project:
- Approved:
- Revision:
- Modified Date:
- CONFIDENTIAL
- Date:
- SW Version:

### Library data of the parts
H1-H6 H9 = Header 3P 2.54 Duc Thang: Cắm; Ten_Linh_Kien: Header 3P XH2.54-3P Đực Thẳng; Don_Vi: Con; Ma_Hang: MH001292; Chung_Loai: Cắm
H7 H8 H10 H11 = Header 2P 2.54 Duc Thang: Cắm; Ten_Linh_Kien: Header 2P XH2.54-2P Đực Thẳng; Don_Vi: Con; Ma_Hang: MH001283; Chung_Loai: Cắm
H12 = Header 4P 2.54 Duc Thang: Cắm; Ten_Linh_Kien: Header 4P XH2.54-4P Đực Thẳng; Don_Vi: Con; Ma_Hang: MH001285; Chung_Loai: Cắm
R24-R30 = R0603_4k7Ω_±1%: as R13 on sheet MCU; LCSC Part #: C138066; Resistance: 4k7Ω; Link: https://www.lcsc.com/product-detail/C138066.html?s_z=n_resistor%25200402%252010R

## Sheet PERIPHERAL.SchDoc: PERIPHERAL
size A3; Author: DODANHLUONG; Revision: 1.0; SheetNumber: 6; SheetTotal: 6; ProjectTitle: DSP_VERSION_1.0
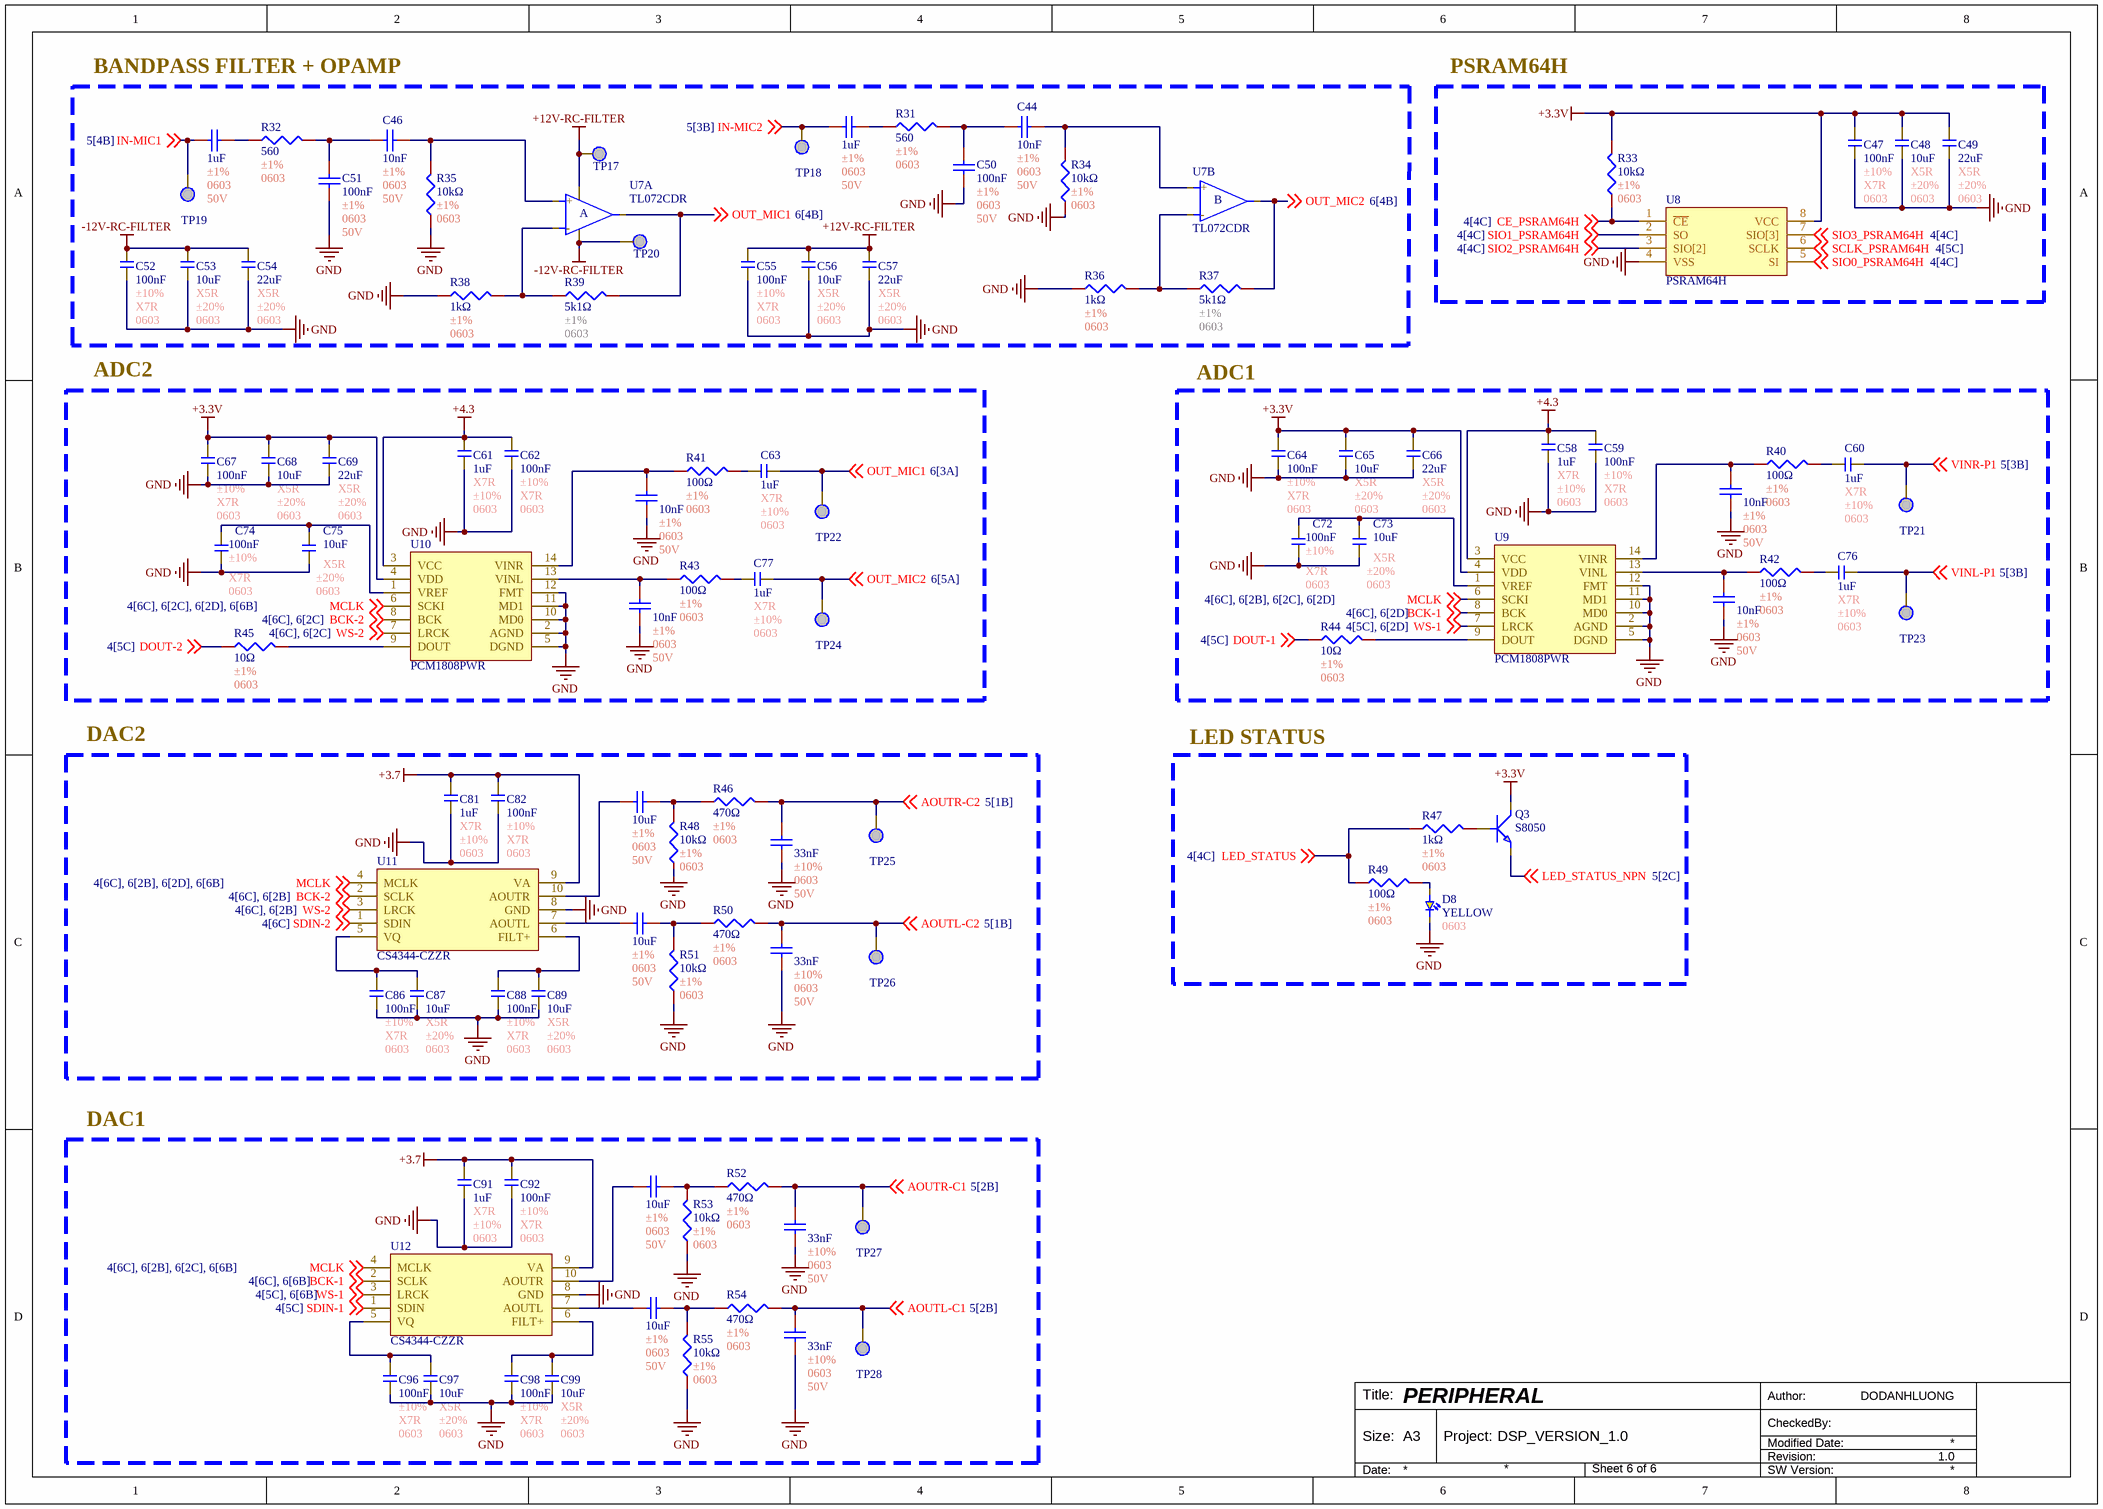
[diagram p4: PERIPHERAL.SchDoc]

### Parts
C43  1uF  Tolerance: ±1%  Package: 0603  Voltage Rating: 50V  [C0603]
C44  10nF  Tolerance: ±1%  Package: 0603  Voltage Rating: 50V  [C0603]
C45  1uF  Tolerance: ±1%  Package: 0603  Voltage Rating: 50V  [C0603]
C46  10nF  Tolerance: ±1%  Package: 0603  Voltage Rating: 50V  [C0603]
C47  100nF  Tolerance: ±10%  Temperature Coefficient: X7R  Package: 0603  [C0603]
C48  10uF  Temperature Coefficient: X5R  Tolerance: ±20%  Package: 0603  [C0603]
C49  22uF  Temperature Coefficient: X5R  Tolerance: ±20%  Package: 0603  [C0603]
C50  100nF  Tolerance: ±1%  Package: 0603  Voltage Rating: 50V  [C0603]
C51  100nF  Tolerance: ±1%  Package: 0603  Voltage Rating: 50V  [C0603]
C52  100nF  Tolerance: ±10%  Temperature Coefficient: X7R  Package: 0603  [C0603]
C53  10uF  Temperature Coefficient: X5R  Tolerance: ±20%  Package: 0603  [C0603]
C54  22uF  Temperature Coefficient: X5R  Tolerance: ±20%  Package: 0603  [C0603]
C55  100nF  Tolerance: ±10%  Temperature Coefficient: X7R  Package: 0603  [C0603]
C56  10uF  Temperature Coefficient: X5R  Tolerance: ±20%  Package: 0603  [C0603]
C57  22uF  Temperature Coefficient: X5R  Tolerance: ±20%  Package: 0603  [C0603]
C58  1uF  Temperature Coefficient: X7R  Tolerance: ±10%  Package: 0603  [C0603]
C59  100nF  Tolerance: ±10%  Temperature Coefficient: X7R  Package: 0603  [C0603]
C60  1uF  Temperature Coefficient: X7R  Tolerance: ±10%  Package: 0603  [C0603]
C61  1uF  Temperature Coefficient: X7R  Tolerance: ±10%  Package: 0603  [C0603]
C62  100nF  Tolerance: ±10%  Temperature Coefficient: X7R  Package: 0603  [C0603]
C63  1uF  Temperature Coefficient: X7R  Tolerance: ±10%  Package: 0603  [C0603]
C64  100nF  Tolerance: ±10%  Temperature Coefficient: X7R  Package: 0603  [C0603]
C65  10uF  Temperature Coefficient: X5R  Tolerance: ±20%  Package: 0603  [C0603]
C66  22uF  Temperature Coefficient: X5R  Tolerance: ±20%  Package: 0603  [C0603]
C67  100nF  Tolerance: ±10%  Temperature Coefficient: X7R  Package: 0603  [C0603]
C68  10uF  Temperature Coefficient: X5R  Tolerance: ±20%  Package: 0603  [C0603]
C69  22uF  Temperature Coefficient: X5R  Tolerance: ±20%  Package: 0603  [C0603]
C70  10nF  Tolerance: ±1%  Package: 0603  Voltage Rating: 50V  [C0603]
C71  10nF  Tolerance: ±1%  Package: 0603  Voltage Rating: 50V  [C0603]
C72  100nF  Tolerance: ±10%  Temperature Coefficient: X7R  Package: 0603  [C0603]
C73  10uF  Temperature Coefficient: X5R  Tolerance: ±20%  Package: 0603  [C0603]
C74  100nF  Tolerance: ±10%  Temperature Coefficient: X7R  Package: 0603  [C0603]
C75  10uF  Temperature Coefficient: X5R  Tolerance: ±20%  Package: 0603  [C0603]
C76  1uF  Temperature Coefficient: X7R  Tolerance: ±10%  Package: 0603  [C0603]
C77  1uF  Temperature Coefficient: X7R  Tolerance: ±10%  Package: 0603  [C0603]
C78  10nF  Tolerance: ±1%  Package: 0603  Voltage Rating: 50V  [C0603]
C79  10nF  Tolerance: ±1%  Package: 0603  Voltage Rating: 50V  [C0603]
C80  10uF  Tolerance: ±1%  Package: 0603  Voltage Rating: 50V  [C0603]
C81  1uF  Temperature Coefficient: X7R  Tolerance: ±10%  Package: 0603  [C0603]
C82  100nF  Tolerance: ±10%  Temperature Coefficient: X7R  Package: 0603  [C0603]
C83  33nF  Tolerance: ±10%  Package: 0603  Voltage Rating: 50V  [C0603]
C84  10uF  Tolerance: ±1%  Package: 0603  Voltage Rating: 50V  [C0603]
C85  33nF  Tolerance: ±10%  Package: 0603  Voltage Rating: 50V  [C0603]
C86  100nF  Tolerance: ±10%  Temperature Coefficient: X7R  Package: 0603  [C0603]
C87  10uF  Temperature Coefficient: X5R  Tolerance: ±20%  Package: 0603  [C0603]
C88  100nF  Tolerance: ±10%  Temperature Coefficient: X7R  Package: 0603  [C0603]
C89  10uF  Temperature Coefficient: X5R  Tolerance: ±20%  Package: 0603  [C0603]
C90  10uF  Tolerance: ±1%  Package: 0603  Voltage Rating: 50V  [C0603]
C91  1uF  Temperature Coefficient: X7R  Tolerance: ±10%  Package: 0603  [C0603]
C92  100nF  Tolerance: ±10%  Temperature Coefficient: X7R  Package: 0603  [C0603]
C93  33nF  Tolerance: ±10%  Package: 0603  Voltage Rating: 50V  [C0603]
C94  10uF  Tolerance: ±1%  Package: 0603  Voltage Rating: 50V  [C0603]
C95  33nF  Tolerance: ±10%  Package: 0603  Voltage Rating: 50V  [C0603]
C96  100nF  Tolerance: ±10%  Temperature Coefficient: X7R  Package: 0603  [C0603]
C97  10uF  Temperature Coefficient: X5R  Tolerance: ±20%  Package: 0603  [C0603]
C98  100nF  Tolerance: ±10%  Temperature Coefficient: X7R  Package: 0603  [C0603]
C99  10uF  Temperature Coefficient: X5R  Tolerance: ±20%  Package: 0603  [C0603]
D8  YELLOW  Package: 0603  [LED0603]
Q3  S8050  [S8050]
R31  560  Tolerance: ±1%  Package: 0603  [R0603]
R32  560  Tolerance: ±1%  Package: 0603  [R0603]
R33  10kΩ  Tolerance: ±1%  Package: 0603  [R0603]
R34  10kΩ  Tolerance: ±1%  Package: 0603  [R0603]
R35  10kΩ  Tolerance: ±1%  Package: 0603  [R0603]
R36  1kΩ  Tolerance: ±1%  Package: 0603  [R0603]
R37  5k1Ω  Tolerance: ±1%  Package: 0603  [R0603]
R38  1kΩ  Tolerance: ±1%  Package: 0603  [R0603]
R39  5k1Ω  Tolerance: ±1%  Package: 0603  [R0603]
R40  100Ω  Tolerance: ±1%  Package: 0603  [R0603]
R41  100Ω  Tolerance: ±1%  Package: 0603  [R0603]
R42  100Ω  Tolerance: ±1%  Package: 0603  [R0603]
R43  100Ω  Tolerance: ±1%  Package: 0603  [R0603]
R44  10Ω  Tolerance: ±1%  Package: 0603  [R0603]
R45  10Ω  Tolerance: ±1%  Package: 0603  [R0603]
R46  470Ω  Tolerance: ±1%  Package: 0603  [R0603]
R47  1kΩ  Tolerance: ±1%  Package: 0603  [R0603]
R48  10kΩ  Tolerance: ±1%  Package: 0603  [R0603]
R49  100Ω  Tolerance: ±1%  Package: 0603  [R0603]
R50  470Ω  Tolerance: ±1%  Package: 0603  [R0603]
R51  10kΩ  Tolerance: ±1%  Package: 0603  [R0603]
R52  470Ω  Tolerance: ±1%  Package: 0603  [R0603]
R53  10kΩ  Tolerance: ±1%  Package: 0603  [R0603]
R54  470Ω  Tolerance: ±1%  Package: 0603  [R0603]
R55  10kΩ  Tolerance: ±1%  Package: 0603  [R0603]
TP17  TP  [TP]  (value not drawn)
TP18  TP  [TP]  (value not drawn)
TP19  TP  [TP]  (value not drawn)
TP20  TP  [TP]  (value not drawn)
TP21  TP  [TP]  (value not drawn)
TP22  TP  [TP]  (value not drawn)
TP23  TP  [TP]  (value not drawn)
TP24  TP  [TP]  (value not drawn)
TP25  TP  [TP]  (value not drawn)
TP26  TP  [TP]  (value not drawn)
TP27  TP  [TP]  (value not drawn)
TP28  TP  [TP]  (value not drawn)
U7  TL072CDR  [TL072CDR]  (parts A,B of 2)
U8  PSRAM64H  [PSRAM64H]
U9  PCM1808PWR  [PCM1808PWR]
U10  PCM1808PWR  [PCM1808PWR]
U11  CS4344-CZZR  [CS4344-CZZR]
U12  CS4344-CZZR  [CS4344-CZZR]

### Blocks framed on the sheet
BANDPASS FILTER + OPAMP: C43-C46 C50-C57 R31 R32 R34-R39 TP17-TP20 U7
PSRAM64H: C47-C49 R33 U8
ADC2: C61-C63 C67-C69 C71 C74 C75 C77 C79 R41 R43 R45 TP22 TP24 U10
ADC1: C58-C60 C64-C66 C70 C72 C73 C76 C78 R40 R42 R44 TP21 TP23 U9
DAC2: C80-C89 R46 R48 R50 R51 TP25 TP26 U11
LED STATUS: D8 Q3 R47 R49
DAC1: C90-C99 R52-R55 TP27 TP28 U12

### Nets
+3.3V: C47.2 C48.2 C49.2 C64.2 C65.2 C66.2 C67.2 C68.2 C69.2 Q3.3(C) R33.2 U8.8(VCC) U9.4(VDD) U10.4(VDD)
+3.7: C81.2 C82.2 C91.2 C92.2 U11.9(VA) U12.9(VA)
+4.3: C58.2 C59.2 C61.2 C62.2 U9.3(VCC) U10.3(VCC)
+12V-RC-FILTER: C55.2 C56.2 C57.2 TP17.1 U7.8
-12V-RC-FILTER: C52.2 C53.2 C54.2 TP20.1 U7.4(GND)
GND: C47.1 C48.1 C49.1 C50.2 C51.2 C52.1 C53.1 C54.1 C55.1 C56.1 C57.1 C58.1 C59.1 C61.1 C62.1 C64.1 C65.1 C66.1 C67.1 C68.1 C69.1 C70.2 C71.2 C72.1 C73.1 C74.1 C75.1 C78.2 C79.2 C81.1 C82.1 C83.2 C85.2 C86.1 C87.1 C88.1 C89.1 C91.1 C92.1 C93.2 C95.2 C96.1 C97.1 C98.1 C99.1 D8.1 R34.1 R35.1 R36.1 R38.1 R48.1 R51.1 R53.1 R55.1 U8.4(VSS) U9.2(AGND) U9.5(DGND) U9.10(MD0) U9.11(MD1) U9.12(FMT) U10.2(AGND) U10.5(DGND) U10.10(MD0) U10.11(MD1) U10.12(FMT) U11.8(GND) U12.8(GND)
AOUTL-C1: C95.1 R54.2 TP28.1 ; off-sheet AOUTL-C1
AOUTL-C2: C85.1 R50.2 TP26.1 ; off-sheet AOUTL-C2
AOUTR-C1: C93.1 R52.2 TP27.1 ; off-sheet AOUTR-C1
AOUTR-C2: C83.1 R46.2 TP25.1 ; off-sheet AOUTR-C2
BCK-1: U9.8(BCK) U12.2(SCLK) ; off-sheet BCK-1
BCK-2: U10.8(BCK) U11.2(SCLK) ; off-sheet BCK-2
CE_PSRAM64H: R33.1 U8.1(~{CE}) ; off-sheet CE_PSRAM64H
DOUT-1: R44.1 ; off-sheet DOUT-1
DOUT-2: R45.1 ; off-sheet DOUT-2
IN-MIC1: C45.2 TP19.1 ; off-sheet IN-MIC1
IN-MIC2: C43.2 TP18.1 ; off-sheet IN-MIC2
LED_STATUS: R47.1 R49.1 ; off-sheet LED_STATUS
LED_STATUS_NPN: Q3.2(E) ; off-sheet LED_STATUS_NPN
MCLK: U9.6(SCKI) U10.6(SCKI) U11.4(MCLK) U12.4(MCLK) ; off-sheet MCLK
OUT_MIC1: C63.1 R39.2 TP22.1 U7.1(out) ; off-sheet OUT_MIC1
OUT_MIC2: C77.1 R37.2 TP24.1 U7.7(out) ; off-sheet OUT_MIC2
SCLK_PSRAM64H: U8.6(SCLK) ; off-sheet SCLK_PSRAM64H
SDIN-1: U12.1(SDIN) ; off-sheet SDIN-1
SDIN-2: U11.1(SDIN) ; off-sheet SDIN-2
SIO0_PSRAM64H: U8.5(SI) ; off-sheet SIO0_PSRAM64H
SIO1_PSRAM64H: U8.2(SO) ; off-sheet SIO1_PSRAM64H
SIO2_PSRAM64H: U8.3(SIO[2]) ; off-sheet SIO2_PSRAM64H
SIO3_PSRAM64H: U8.7(SIO[3]) ; off-sheet SIO3_PSRAM64H
VINL-P1: C76.1 TP23.1 ; off-sheet VINL-P1
VINR-P1: C60.1 TP21.1 ; off-sheet VINR-P1
WS-1: U9.7(LRCK) U12.3(LRCK) ; off-sheet WS-1
WS-2: U10.7(LRCK) U11.3(LRCK) ; off-sheet WS-2
NetC43_1: C43.1 R31.1
NetC44_1: C44.1 C50.1 R31.2
NetC44_2: C44.2 R34.2 U7.5(+)
NetC45_1: C45.1 R32.1
NetC46_1: C46.1 C51.1 R32.2
NetC46_2: C46.2 R35.2 U7.3(+)
NetC60_2: C60.2 R40.2
NetC63_2: C63.2 R41.2
NetC70_1: C70.1 R40.1 U9.14(VINR)
NetC71_1: C71.1 R41.1 U10.14(VINR)
NetC72_2: C72.2 C73.2 U9.1(VREF)
NetC74_2: C74.2 C75.2 U10.1(VREF)
NetC76_2: C76.2 R42.2
NetC77_2: C77.2 R43.2
NetC78_1: C78.1 R42.1 U9.13(VINL)
NetC79_1: C79.1 R43.1 U10.13(VINL)
NetC80_1: C80.1 R46.1 R48.2
NetC80_2: C80.2 U11.10(AOUTR)
NetC84_1: C84.1 R50.1 R51.2
NetC84_2: C84.2 U11.7(AOUTL)
NetC86_2: C86.2 C87.2 U11.5(VQ)
NetC88_2: C88.2 C89.2 U11.6(FILT+)
NetC90_1: C90.1 R52.1 R53.2
NetC90_2: C90.2 U12.10(AOUTR)
NetC94_1: C94.1 R54.1 R55.2
NetC94_2: C94.2 U12.7(AOUTL)
NetC96_2: C96.2 C97.2 U12.5(VQ)
NetC98_2: C98.2 C99.2 U12.6(FILT+)
NetD8_2: D8.2 R49.2
NetQ3_1: Q3.1(B) R47.2
NetR36_2: R36.2 R37.1 U7.6(-)
NetR38_2: R38.2 R39.1 U7.2(-)
NetR44_2: R44.2 U9.9(DOUT)
NetR45_2: R45.2 U10.9(DOUT)

### Notes on the sheet
- Author:
- Title:
- Size:
- A3
- Project:
- Revision:
- Modified Date:
- CheckedBy:
- Date:
- SW Version:
- (in symbol TL072CDR, part A) A
- (in symbol TL072CDR, part B) B

### Library data of the parts
C43 C45 = C0603_1uF_±1%: 50V 10pF NP0 ±1% 0402 Multilayer Ceramic Capacitors MLCC - SMD/SMT ROHS; Manufacturer: YAGEO; Mfr. Part #: CC0402FRNPO9BN100; LCSC Part #: C513681; Link: https://www.lcsc.com/product-detail/C513681.html?s_z=n_capital%2520yageo%252010pF%25200402; Capacitance: 1uF
C44 C46 C70 C71 C78 C79 = C0603_10nF_±1%: 50V 10pF NP0 ±1% 0402 Multilayer Ceramic Capacitors MLCC - SMD/SMT ROHS; Manufacturer: YAGEO; Mfr. Part #: CC0402FRNPO9BN100; LCSC Part #: C513681; Link: https://www.lcsc.com/product-detail/C513681.html?s_z=n_capital%2520yageo%252010pF%25200402; Capacitance: 10nF
C47 C52 C55 C59 C62 C64 C67 C72 C74 C82 C86 C88 C92 C96 C98 = C0603_100nF_±10%_X7R: as C1 on sheet Voltage Source; LCSC Part #: C14663; Capacitance: 100nF; Link: https://www.lcsc.com/product-detail/C14663.html?s_z=n_capital%25200603%2520100nf
C48 C53 C56 C65 C68 C73 C75 C87 C89 C97 C99 = C0603_10uF_±10%_X7R: as C3 on sheet Voltage Source; LCSC Part #: C596327; Capacitance: 10uF; Link: https://www.lcsc.com/product-detail/C596327.html?s_z=n_capital%25200603%252010uF%2520yageo
C49 C54 C57 C66 C69 = C0603_22uF_±20%_X5R: as C4 on sheet Voltage Source; LCSC Part #: C109448; ComponentLink1Description: New link; ComponentLink1URL: *; Capacitance: 22uF; Link: https://www.lcsc.com/product-detail/C109448.html?s_z=n_capital%25200603%252022uf%2520yageo
C50 C51 = C0603_10nF_±1%: 50V 10pF NP0 ±1% 0402 Multilayer Ceramic Capacitors MLCC - SMD/SMT ROHS; Manufacturer: YAGEO; Mfr. Part #: CC0402FRNPO9BN100; Capacitance: 10nF; LCSC Part #: C513681; Link: https://www.lcsc.com/product-detail/C513681.html?s_z=n_capital%2520yageo%252010pF%25200402
C58 C60 C61 C63 C76 C77 C81 C91 = C0603_1uF_±10%_X7R: as C5 on sheet Voltage Source; LCSC Part #: C559769; Capacitance: 1uF; Link: https://www.lcsc.com/product-detail/C559769.html?s_z=n_capital%25200603%25201uF%2520yageo
C80 C84 C90 C94 = C0603_10uF_±1%: 50V 10pF NP0 ±1% 0402 Multilayer Ceramic Capacitors MLCC - SMD/SMT ROHS; Manufacturer: YAGEO; Mfr. Part #: CC0402FRNPO9BN100; LCSC Part #: C513681; Link: https://www.lcsc.com/product-detail/C513681.html?s_z=n_capital%2520yageo%252010pF%25200402; Capacitance: 10uF
C83 C85 C93 C95 = C0603_33nF_±10%: 100mW Thick Film Resistor 75V ±100ppm/℃ ±1% 470Ω 0603 Chip Resistor - Surface Mount ROHS; Manufacturer: YAGEO; Mfr. Part #: CC0603KRX7R9BB333; Temperature Coefficient: X7R; LCSC Part #: C106856; Link: https://www.lcsc.com/product-detail/C106856.html?s_z=n_capital%2520yageo%25200603%252033nF; Capacitance: 33nF
D8 = D0603_YELLOW: as D3 on sheet Voltage Source; LCSC Part #: C965793; Power(Watts): 60mW; Link: https://www.lcsc.com/product-detail/C136765.html?s_z=n_LED%25200402%2520RED; Illumination Color: YELLOW
Q3 = S8050: as Q1 on sheet Voltage Source; Mfr. Part #: S8050; LCSC Part #: C916390; Package: SOT-23; Link: https://www.lcsc.com/product-detail/C916390.html?s_z=n_s8050; Current - Collector(Ic): 500mA
R31 R32 = R0603_1kΩ_±1%: 62.5mW Thick Film Resistor 50V ±1% ±200ppm/℃ 10Ω 0402 Chip Resistor - Surface Mount ROHS; Manufacturer: YAGEO; Mfr. Part #: RC0402FR-0710RL; Resistance: 1kΩ; LCSC Part #: C138066; Link: https://www.lcsc.com/product-detail/C138066.html?s_z=n_resistor%25200402%252010R
R33-R35 R48 R51 R53 R55 = R0603_10kΩ_±1%: as R7 on sheet Voltage Source; LCSC Part #: C138066; Resistance: 10kΩ; Link: https://www.lcsc.com/product-detail/C138066.html?s_z=n_resistor%25200402%252010R
R36 R38 R47 = R0603_1kΩ_±1%: as R6 on sheet Voltage Source; LCSC Part #: C138066; Resistance: 1kΩ; Link: https://www.lcsc.com/product-detail/C138066.html?s_z=n_resistor%25200402%252010R
R37 R39 = R0603_5k1Ω_±1%: as R1 on sheet Voltage Source; LCSC Part #: C2907044; Link: https://www.lcsc.com/product-detail/C2907044.html?s_z=n_5k1%25200603; Resistance: 5k1Ω
R40-R43 R49 = R0603_100Ω_±1%: 62.5mW Thick Film Resistor 50V ±1% ±200ppm/℃ 10Ω 0402 Chip Resistor - Surface Mount ROHS; Manufacturer: YAGEO; Mfr. Part #: RC0402FR-0710RL; LCSC Part #: C138066; Resistance: 100Ω; Link: https://www.lcsc.com/product-detail/C138066.html?s_z=n_resistor%25200402%252010R
R44 R45 = R0603_10Ω_±1%: as R17 on sheet MCU; LCSC Part #: C138066; Resistance: 10Ω; Link: https://www.lcsc.com/product-detail/C138066.html?s_z=n_resistor%25200402%252010R
R46 R50 R52 R54 = R0603_470Ω_±1%_1: 62.5mW Thick Film Resistor 50V ±1% ±200ppm/℃ 10Ω 0402 Chip Resistor - Surface Mount ROHS; Manufacturer: YAGEO; Mfr. Part #: RC0603FR-07470RL; Key Attributes: RES 470Ω ±1% 100mW 0603; LCSC Part #: C114669; Resistance: 470Ω; Link: https://www.lcsc.com/product-detail/C114669.html?s_z=n_resistor%2520470%25CE%25A9%25200603%2520yageo
U7 = TL072CDR: 3mV 65pA 3MHz 13V/us 2 SOIC-8 FET Input Amplifiers ROHS; Manufacturer: TI; Noise density(eN): 18nV/√Hz@1kHz; Dual Supply: -15V~15V; Number of Channels: 2; LCSC Part #: C67473; Package: SOIC-8; Gain Bandwidth Product: 3MHz; Link: https://www.lcsc.com/product-detail/C67473.html?s_z=n_TL072CDR; Mfr. Part #: TL072CDR
U9 U10 = PCM1808PWR: 4.5V~5.5V 24 I2S TSSOP-14 ADCs/DACs - Special Purpose ROHS; Manufacturer: TI; Key Attributes: Single-ended analog input 24-bit 96kHz stereo A/D converter; Number of Channels: 2; Mfr. Part #: PCM1808PWR; LCSC Part #: C55513; Package: TSSOP-14; Voltage - Supply: 4.5V~5.5V; Interface: I2S; Link: https://www.lcsc.com/product-detail/C55513.html?s_z=n_pcm1808
U11 U12 = CS4344-CZZR: 250ms I2S 3.3V~5V 24 TSSOP-10-3mm Digital to Analog Converters (DAC) ROHS; Manufacturer: Cirrus Logic; Key Attributes: 10-Pin, 24-Bit, 192 kHz Stereo D/A Converter; Number of Channels: 2; Mfr. Part #: CS4344-CZZR; LCSC Part #: C8952; Package: TSSOP-10-3mm; Link: https://www.lcsc.com/product-detail/C8952.html?s_z=n_cs4344; Voltage - Supply: 3.3V~5V; Interface: I2S

## Nets that join several sheets
+3.3V: Voltage Source (11 pins), MCU (8 pins), CONNECTOR (9 pins), PERIPHERAL (14 pins)
+3.7: Voltage Source (C6.2 D1.1 TP2.1), PERIPHERAL (6 pins)
+4.3: Voltage Source (C5.2 D1.2 D2.1 TP1.1), PERIPHERAL (6 pins)
+12V-RC-FILTER: Voltage Source (C20.1 R9.2), PERIPHERAL (5 pins)
-12V-RC-FILTER: Voltage Source (C27.1 R11.2), PERIPHERAL (5 pins)
GND: Voltage Source (55 pins), MCU (7 pins), CONNECTOR (16 pins), PERIPHERAL (67 pins)
A1: MCU (U6.9), CONNECTOR (H1.3 R25.1)
A2: MCU (U6.7), CONNECTOR (H2.3 R27.1)
A3: MCU (U6.5), CONNECTOR (H3.3 R29.1)
AOUTL-C1: CONNECTOR (H6.1), PERIPHERAL (C95.1 R54.2 TP28.1)
AOUTL-C2: CONNECTOR (H5.3), PERIPHERAL (C85.1 R50.2 TP26.1)
AOUTR-C1: CONNECTOR (H6.3), PERIPHERAL (C93.1 R52.2 TP27.1)
AOUTR-C2: CONNECTOR (H5.1), PERIPHERAL (C83.1 R46.2 TP25.1)
B1: MCU (U6.8), CONNECTOR (H1.1 R24.2)
B2: MCU (U6.6), CONNECTOR (H2.1 R26.2)
B3: MCU (U6.4), CONNECTOR (H3.1 R28.2)
BCK-1: MCU (R18.2), PERIPHERAL (U9.8 U12.2)
BCK-2: MCU (R21.2), PERIPHERAL (U10.8 U11.2)
BUTTON_STATUS: MCU (U6.12), CONNECTOR (H10.1 R30.1)
CE_PSRAM64H: MCU (U6.16), PERIPHERAL (R33.1 U8.1)
DOUT-1: MCU (U6.31), PERIPHERAL (R44.1)
DOUT-2: MCU (U6.27), PERIPHERAL (R45.1)
EN: Voltage Source (Q1.3), MCU (R13.2 TP9.1 U6.3)
I2C1_SCL: MCU (U6.11), CONNECTOR (H12.3)
I2C1_SDA: MCU (U6.10), CONNECTOR (H12.2)
IN-MIC1: CONNECTOR (H7.1), PERIPHERAL (C45.2 TP19.1)
IN-MIC2: CONNECTOR (H8.1), PERIPHERAL (C43.2 TP18.1)
IO0: Voltage Source (Q2.3), MCU (R14.2 R17.1 TP10.1 U6.25)
IR1838B: MCU (U6.13), CONNECTOR (H9.3)
LED_STATUS: MCU (U6.14), PERIPHERAL (R47.1 R49.1)
LED_STATUS_NPN: CONNECTOR (H11.1), PERIPHERAL (Q3.2)
MCLK: MCU (R17.2), PERIPHERAL (U9.6 U10.6 U11.4 U12.4)
RXD: Voltage Source (U1.3), MCU (D7.1 U6.35), CONNECTOR (TP12.1)
SCLK_PSRAM64H: MCU (U6.24), PERIPHERAL (U8.6)
SDIN-1: MCU (R20.2), PERIPHERAL (U12.1)
SDIN-2: MCU (R23.2), PERIPHERAL (U11.1)
SIO0_PSRAM64H: MCU (U6.22), PERIPHERAL (U8.5)
SIO1_PSRAM64H: MCU (U6.21), PERIPHERAL (U8.2)
SIO2_PSRAM64H: MCU (U6.18), PERIPHERAL (U8.3)
SIO3_PSRAM64H: MCU (U6.17), PERIPHERAL (U8.7)
TXD: Voltage Source (U1.2), MCU (D6.1 U6.34), CONNECTOR (TP14.1)
VINL-P1: CONNECTOR (H4.3), PERIPHERAL (C76.1 TP23.1)
VINR-P1: CONNECTOR (H4.1), PERIPHERAL (C60.1 TP21.1)
WS-1: MCU (R19.2), PERIPHERAL (U9.7 U12.3)
WS-2: MCU (R22.2), PERIPHERAL (U10.7 U11.3)